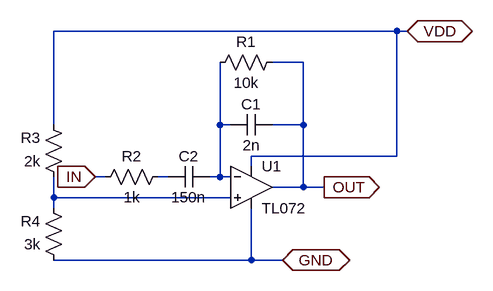
[diagram p0: schematic filter.asc]
filter.asc, the LTspice schematic file:
Version 4
SHEET 1 1964 680
WIRE 1856 96 1328 96
WIRE 1872 96 1856 96
WIRE 1712 144 1664 144
WIRE 1328 240 1328 96
WIRE 1584 240 1584 144
WIRE 1600 240 1584 240
WIRE 1712 240 1712 144
WIRE 1712 240 1664 240
WIRE 1856 288 1856 96
WIRE 1856 288 1632 288
WIRE 1632 304 1632 288
WIRE 1408 320 1392 320
WIRE 1504 320 1488 320
WIRE 1584 320 1584 240
WIRE 1584 320 1568 320
WIRE 1600 320 1584 320
WIRE 1712 336 1712 240
WIRE 1712 336 1664 336
WIRE 1744 336 1712 336
WIRE 1328 352 1328 320
WIRE 1600 352 1328 352
WIRE 1328 368 1328 352
WIRE 1632 448 1632 368
WIRE 1632 448 1328 448
WIRE 1680 448 1632 448
FLAG 1392 320 IN
IOPIN 1392 320 In
FLAG 1744 336 OUT
IOPIN 1744 336 Out
FLAG 1872 96 VDD
IOPIN 1872 96 BiDir
FLAG 1680 448 GND
IOPIN 1680 448 BiDir
SYMBOL Opamps/TL072 1632 272 R0
SYMATTR InstName U1
SYMBOL cap 1664 224 R90
WINDOW 0 0 32 VBottom 2
WINDOW 3 32 32 VTop 2
SYMATTR InstName C1
SYMATTR Value 2n
SYMBOL cap 1568 304 R90
WINDOW 0 0 32 VBottom 2
WINDOW 3 32 32 VTop 2
SYMATTR InstName C2
SYMATTR Value 150n
SYMBOL res 1680 128 R90
WINDOW 0 0 56 VBottom 2
WINDOW 3 32 56 VTop 2
SYMATTR InstName R1
SYMATTR Value 10k
SYMBOL res 1504 304 R90
WINDOW 0 0 56 VBottom 2
WINDOW 3 32 56 VTop 2
SYMATTR InstName R2
SYMATTR Value 1k
SYMBOL res 1344 336 R180
WINDOW 0 36 76 Left 2
WINDOW 3 36 40 Left 2
SYMATTR InstName R3
SYMATTR Value 2k
SYMBOL res 1344 464 R180
WINDOW 0 36 76 Left 2
WINDOW 3 36 40 Left 2
SYMATTR InstName R4
SYMATTR Value 3k

The netlist it stands for:
* filter.asc
XU1 N003 N001 VDD GND OUT TL072  ; pins In+ In- V+ V- OUT
C1 OUT N001 2n
C2 N001 N002 150n
R1 OUT N001 10k
R2 N002 IN 1k
R3 N003 VDD 2k
R4 GND N003 3k
.backanno
.end